# EAGLE design TemplateNut (EAGLE 6.3)
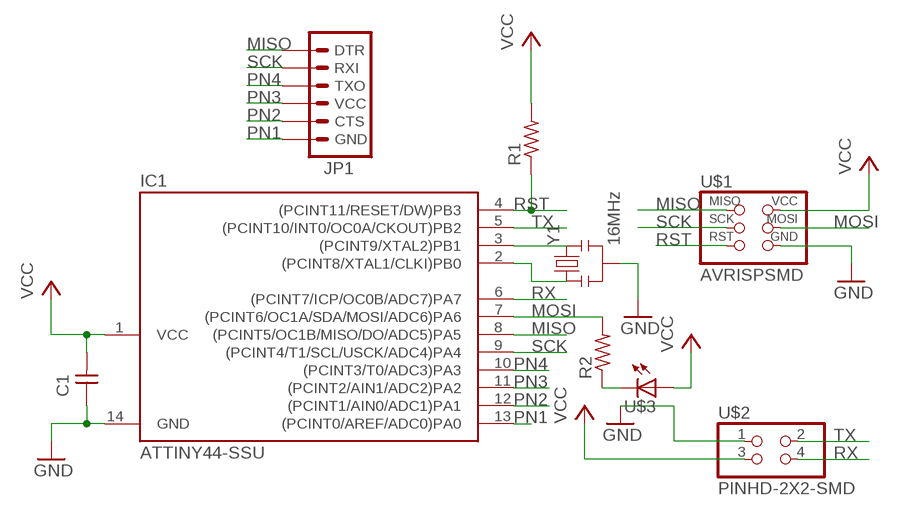
[diagram p0: schematic, sheet 1]

## Parts
C1  UNPOLARIZED_CAPACITOR1206  [1206]
IC1  ATTINY44-SSU  [SOIC14]
JP1  FTDI_CONNECTORSMD  [1X06-SMD]
R1  RESISTOR1206  [1206]
R2  RESISTOR1206  [1206]
U$1  AVRISPSMD  [2X03SMD]
U$2  PINHD-2X2-SMD  [2X02SMD]
U$3  LED1206  [1206]
Y1  16MHz  RESONATOR16MHZ  [RESONATOR-SMD]

## Nets
GND: C1.1 IC1.14(GND) U$1.6(GND) U$2.1 Y1.2
MISO: IC1.8((PCINT5/OC1B/MISO/DO/ADC5)PA5) JP1.1(DTR) U$1.1(MISO)
MOSI: IC1.7((PCINT6/OC1A/SDA/MOSI/ADC6)PA6) R2.2 U$1.4(MOSI)
N$1: IC1.2((PCINT8/XTAL1/CLKI)PB0) Y1.1
N$2: IC1.3((PCINT9/XTAL2)PB1) Y1.3
N$3: R2.1 U$3.2(C)
PN1: IC1.13((PCINT0/AREF/ADC0)PA0) JP1.6(GND)
PN2: IC1.12((PCINT1/AIN0/ADC1)PA1) JP1.5(CTS)
PN3: IC1.11((PCINT2/AIN1/ADC2)PA2) JP1.4(VCC)
PN4: IC1.10((PCINT3/T0/ADC3)PA3) JP1.3(TXO)
RST: IC1.4((PCINT11/RESET/DW)PB3) R1.1 U$1.5(RST)
RX: IC1.6((PCINT7/ICP/OC0B/ADC7)PA7) U$2.4
SCK: IC1.9((PCINT4/T1/SCL/USCK/ADC4)PA4) JP1.2(RXI) U$1.3(SCK)
TX: IC1.5((PCINT10/INT0/OC0A/CKOUT)PB2) U$2.2
VCC: C1.2 IC1.1(VCC) R1.2 U$1.2(VCC) U$2.3 U$3.1(A)

## Library data of the parts
C1 = fabPatil:UNPOLARIZED_CAPACITOR: unpolarized_capacitor
IC1 = fabPatil:ATTINY44
JP1 = fabPatil:FTDI_CONNECTOR: FTDI connector smd
R1 R2 = fabPatil:RESISTOR
U$1 = fabPatil:AVRISP
U$2 = fabPatil:PINHD-2X2-SMD
U$3 = fabPatil:LED
Y1 = fabPatil:RESONATOR: Resonator Small SMD resonator. Used, eg, on the Arduino Pro/ Pro Mini boards. 8MHz- XTAL-08895 16MHz- XTAL-08900; PROD_ID: XTAL-08900

## Board
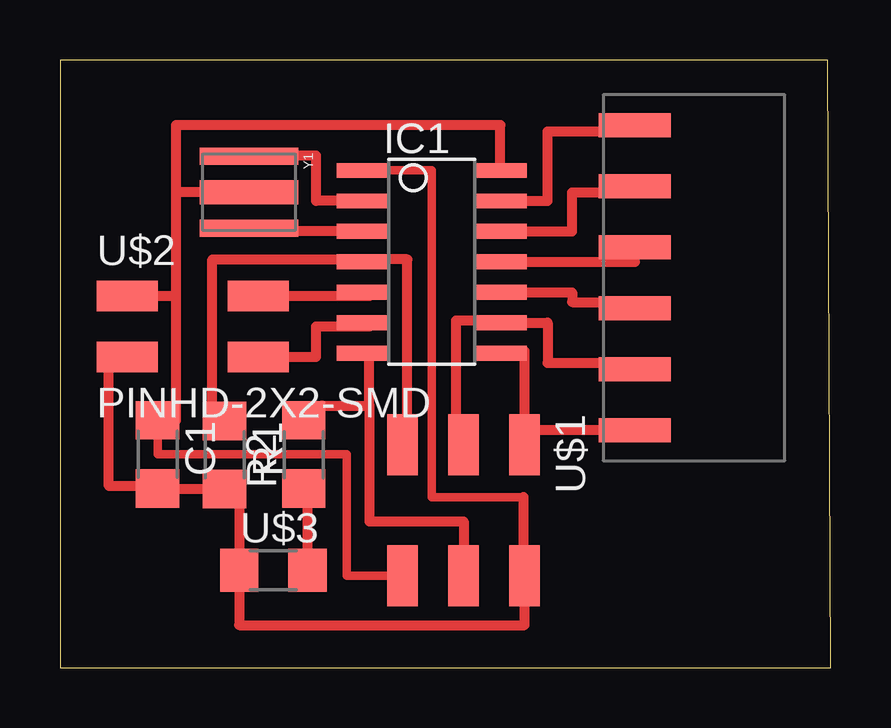
[diagram p1: board, top side]
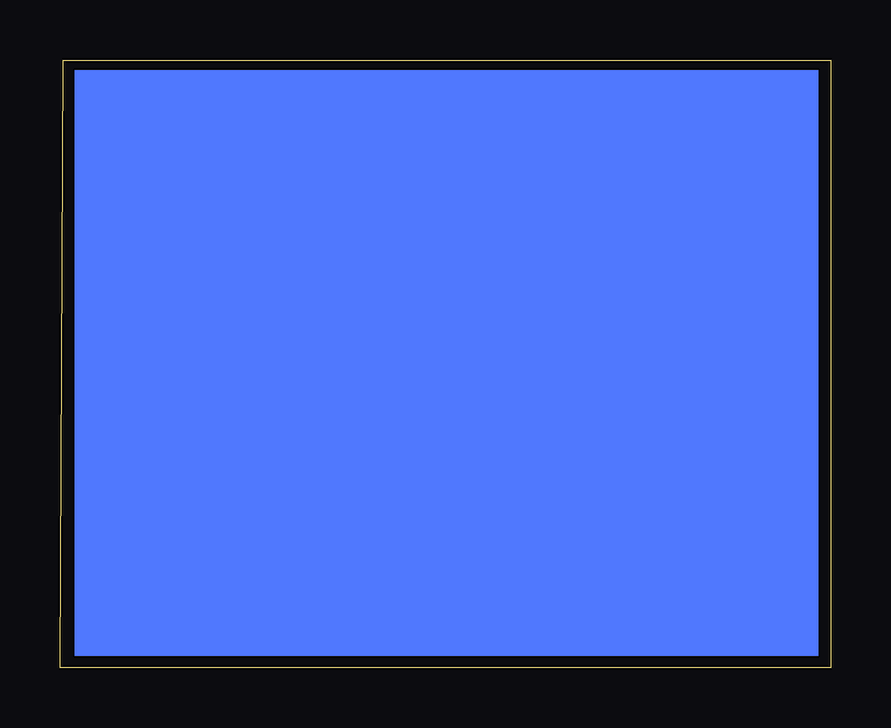
[diagram p2: board, bottom side, seen from below]

Size 32.11 x 25.32 mm. Coordinates in mm from the lower left corner, seen from the top.
Outline: 0,0 32.11,0 31.98,25.32 0,25.32 0,0
Copper layers (1*16): Top 0.035mm / dielectric 1.5mm / Bottom 0.035mm
Design rules "Patil": minimum track width 10mil, minimum drill 24mil, track to track 16mil, track to pad 16mil, pad to pad 16mil, via to via 16mil, smd to smd 16mil, copper to edge 40mil, drill to drill 8mil, minimum pad ring 10mil, minimum via ring 8mil, stop-mask expansion 4mil, vias tented up to drill 0mil, thermal gap 10mil

### Footprints (pad centres in the part's own frame; a part is rotated, then mirrored left to right if it is on the bottom)
1206 = smd 1.6 x 1.803: 1 -1.422,0; 2 1.422,0
SOIC14 = smd 0.61 x 2.21: 1 -3.81,-2.857; 2 -2.54,-2.857; 3 -1.27,-2.857; 4 0,-2.857; 5 1.27,-2.857; 6 2.54,-2.857; 7 3.81,-2.857; 8 3.81,2.857; 9 2.54,2.857; 10 1.27,2.857; 11 0,2.857; 12 -1.27,2.857; 13 -2.54,2.857; 14 -3.81,2.857
1X06-SMD = smd 1 x 3: 1 -6.35,5; 2 -3.81,5; 3 -1.27,5; 4 1.27,5; 5 3.81,5; 6 6.35,5
2X03SMD = smd 2.54 x 1.27: 1 -2.54,2.54; 2 2.92,2.54; 3 -2.54,0; 4 2.92,0; 5 -2.54,-2.54; 6 2.92,-2.54
2X02SMD = smd 2.54 x 1.27: 1 -2.54,1.27; 2 2.92,1.27; 3 -2.54,-1.27; 4 2.92,-1.27
RESONATOR-SMD = smd 0.7 x 4.1: 1 -1.5,0; 3 1.5,0 | smd 1 x 4.1: 2 0,0

### Placement (x,y rotation side)
C1  4.06,8.89 270 top
IC1  15.49,16.92 270 top
JP1  28.96,16.26 90 top
R1  6.86,8.86 270 top
R2  10.16,8.89 90 top
U$1  16.81,6.76 270 top
U$2  5.33,14.22 0 top
U$3  8.89,4.06 0 top
Y1  7.87,19.81 270 top

### Tracks (layer width: path | path; a pad name or v marks a point on that pad's centre or on a via)
GND
  Top 0.356: U$1.6 11.94,3.84 11.94,8.89 4.06,8.89 C1.1
  Top 0.406: IC1.14 18.35,22.61 4.83,22.61 4.83,19.81 | Y1.2 4.83,19.81 | 4.83,19.81 4.83,15.49 | U$2.1 4.83,15.49 | 4.83,15.49 4.83,10.31 C1.1
MISO
  Top 0.406: IC1.8 19.05,13.11 19.05,13.21 19.36,13.21 U$1.1 19.36,9.91 JP1.1
MOSI
  Top 0.406: 12.89,10.92 12.89,6.1 16.82,6.1 U$1.4 | R2.2 10.92,10.92 12.89,10.92 | 12.89,10.92 12.89,13.11 IC1.7
N$1
  Top 0.406: IC1.2 10.67,19.46 10.67,21.34 7.87,21.34 Y1.1
N$2
  Top 0.406: IC1.3 7.87,18.19 Y1.3
N$3
  Top 0.406: R2.1 10.31,7.47 U$3.2
PN1
  Top 0.406: IC1.13 20.32,19.46 20.32,22.35 23.96,22.35 JP1.6
PN2
  Top 0.406: IC1.12 21.34,18.19 21.34,19.81 23.96,19.81 JP1.5
PN3
  Top 0.406: IC1.11 23.96,16.92 JP1.4
PN4
  Top 0.406: IC1.10 21.34,15.65 21.34,15.24 23.96,15.24 JP1.3
RST
  Top 0.254: 13.04,16.76 IC1.4
  Top 0.406: R1.1 6.35,10.41 6.35,17.02 12.89,17.02 IC1.4 12.64,17.02 14.48,17.02 14.48,9.3 U$1.5
RX
  Top 0.406: U$2.4 10.67,12.95 10.67,14.22 12.89,14.22 IC1.6
SCK
  Top 0.406: U$1.3 16.51,9.3 16.51,14.48 18.35,14.48 IC1.9 20.32,14.38 20.32,12.7 23.96,12.7 JP1.2
TX
  Top 0.406: U$2.2 12.89,15.49 IC1.5
VCC
  Top 0.254: 19.3,3.84 U$1.2
  Top 0.356: IC1.1 15.49,20.73 15.49,7.11 19.3,7.11
  Top 0.406: 19.3,7.11 19.3,3.84 | U$1.2 19.36,1.78 7.47,1.78 U$3.1 7.47,7.57 R1.2 6.86,7.47 C1.2 4.06,7.57 2.03,7.57 2.03,12.95 U$2.3
(copper drawn outside any net)
  shapes: Bottom area x1